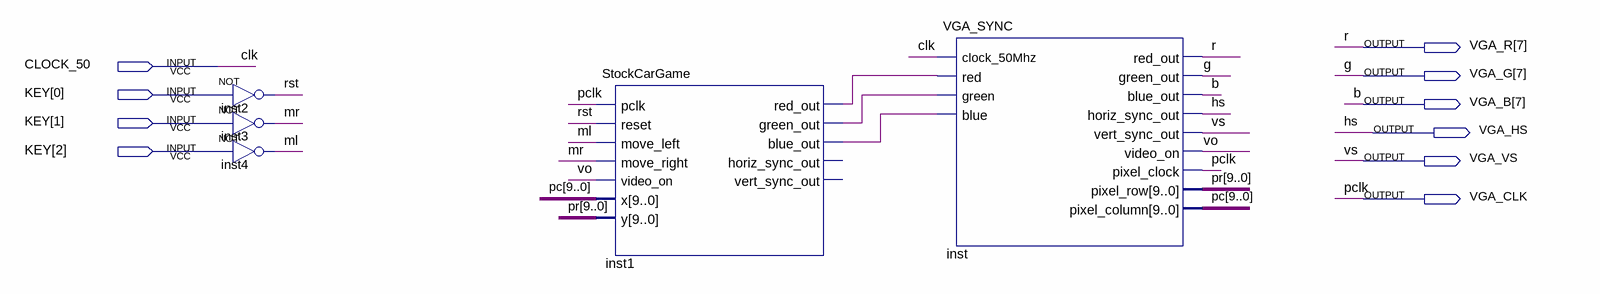
[diagram p0: schematic sheet]
// Quartus schematic ProjetoBase.bdf as structural Verilog: 5 symbols, 10 pins
module ProjetoBase (
  input  CLOCK_50,
  input  [2:0] KEY,
  output [7:7] VGA_R,
  output [7:7] VGA_G,
  output [7:7] VGA_B,
  output VGA_HS,
  output VGA_VS,
  output VGA_CLK
);

  wire inst1_blue_out, inst1_green_out, inst1_red_out, ml, mr, rst, vo;
  wire [9:0] pc, pr;

  not inst2 (rst, KEY[0]);
  not inst3 (mr, KEY[1]);
  not inst4 (ml, KEY[2]);
  StockCarGame inst1 (
    .pclk(VGA_CLK), .reset(rst), .move_left(ml), .move_right(mr), .video_on(vo), .x(pc), .y(pr),
    .red_out(inst1_red_out), .green_out(inst1_green_out), .blue_out(inst1_blue_out));  // open: horiz_sync_out, vert_sync_out
  VGA_SYNC inst (
    .clock_50Mhz(CLOCK_50), .red(inst1_red_out), .green(inst1_green_out), .blue(inst1_blue_out),
    .red_out(VGA_R[7]), .green_out(VGA_G[7]), .blue_out(VGA_B[7]), .horiz_sync_out(VGA_HS),
    .vert_sync_out(VGA_VS), .video_on(vo), .pixel_clock(VGA_CLK), .pixel_row(pr), .pixel_column(pc));

  // Other names for the same wires on the sheet: b = VGA_B[7]; clk = CLOCK_50; g = VGA_G[7]; hs = VGA_HS;
  //   pclk = VGA_CLK; r = VGA_R[7]; vs = VGA_VS
endmodule
